# EAGLE design LipSync_Interface_Board (EAGLE 9.0.1)
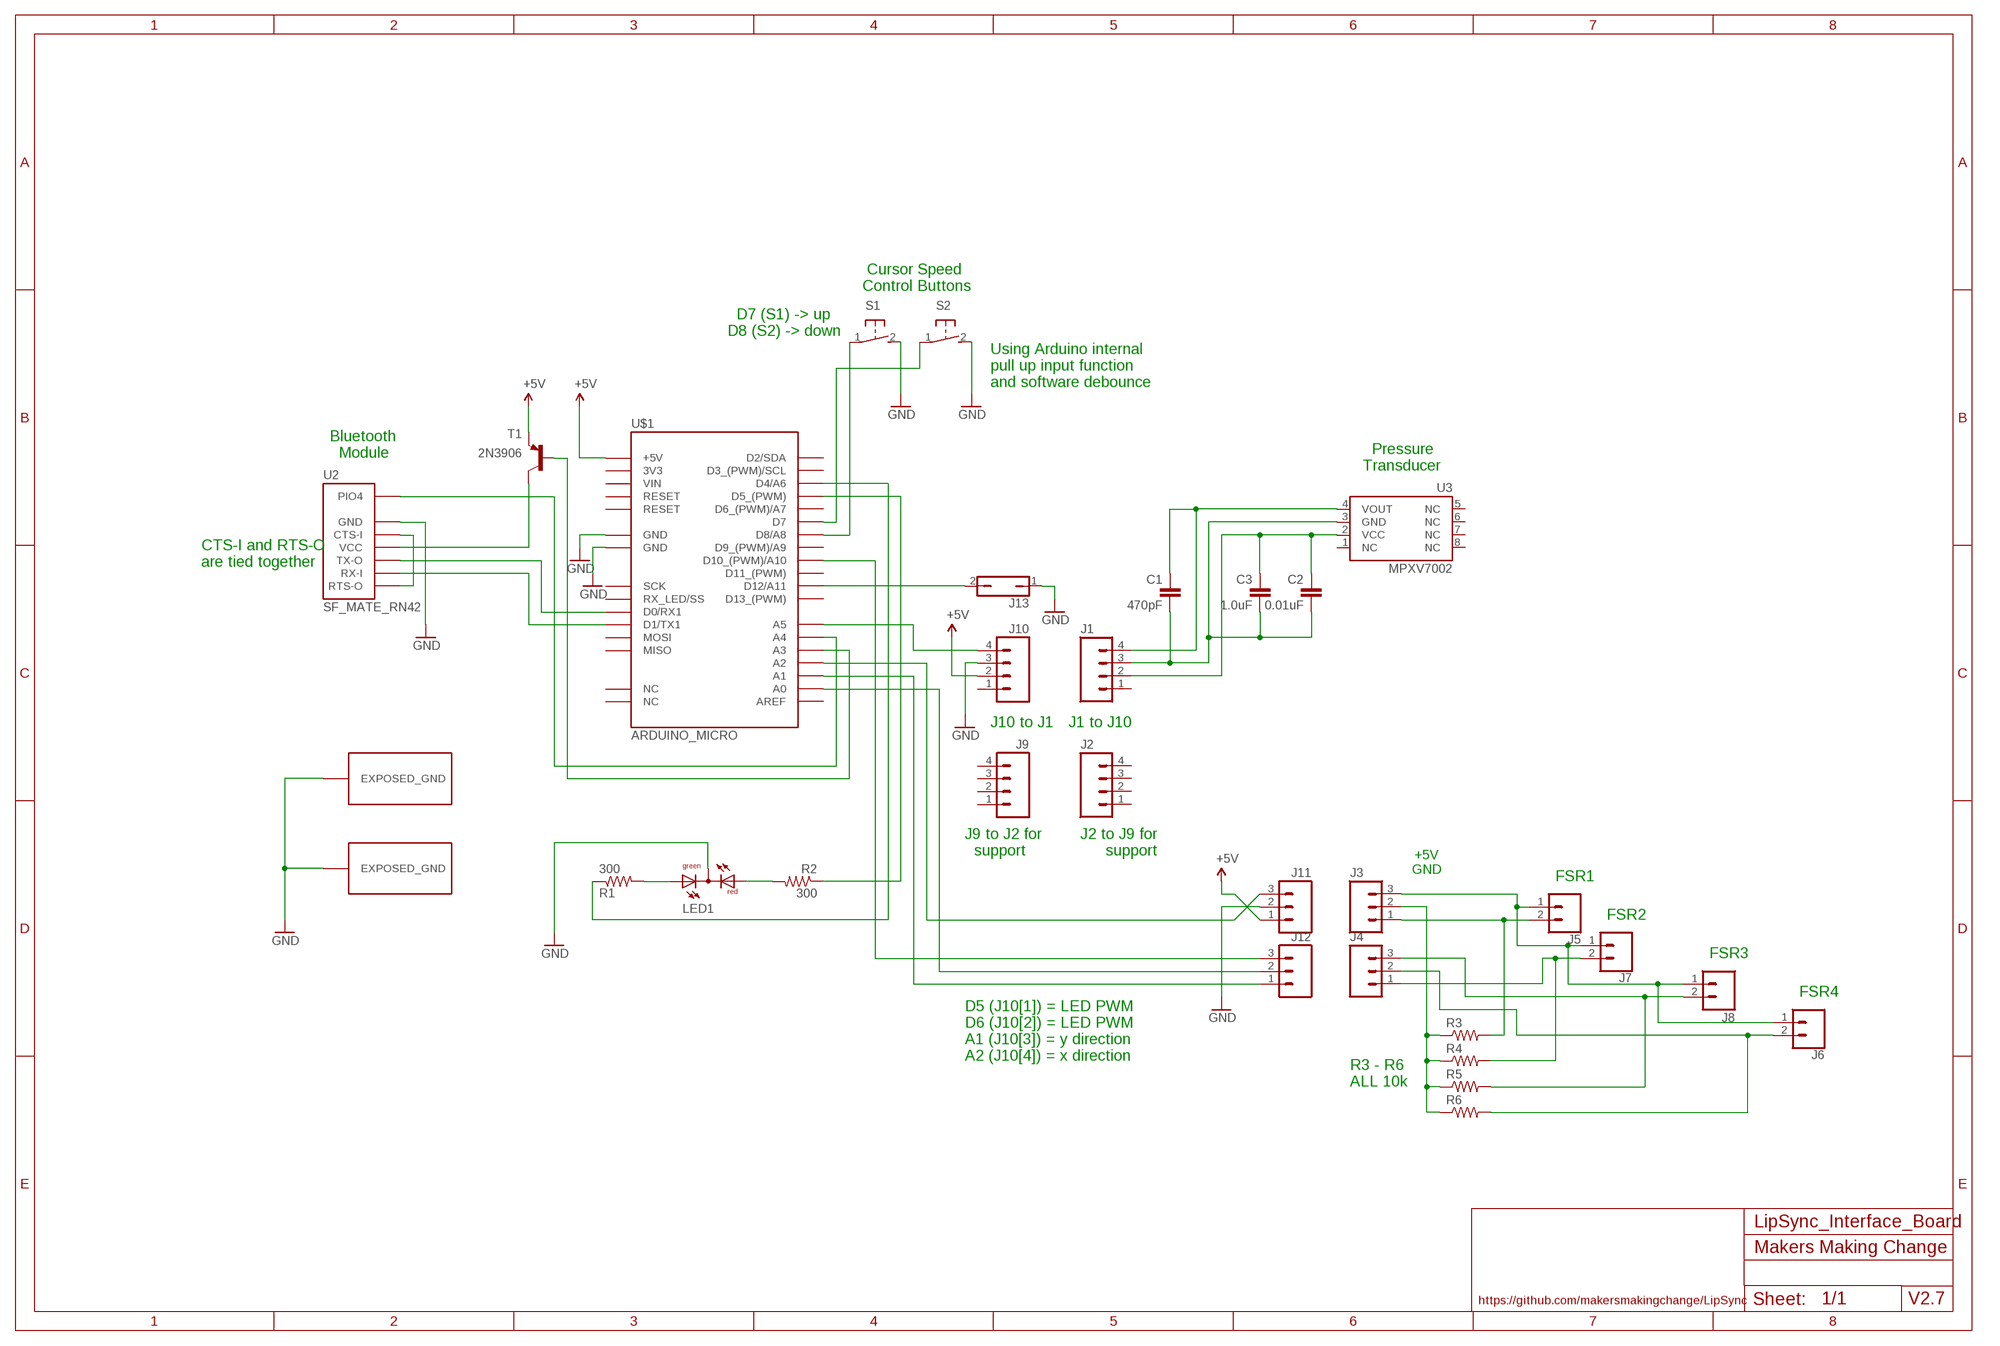
[diagram p0: schematic, sheet 1]

## Parts
C1  470pF  CAPEZ  [CAP-PTH-SMALLEZ]
C2  0.01uF  CAPEZ  [CAP-PTH-SMALLEZ]
C3  1.0uF  CAPEZ  [CAP-PTH-SMALLEZ]
J1  M04PTH  [1X04]
J2  M04PTH  [1X04]
J3  M03LOCK  [1X03_LOCK]
J4  M03LOCK  [1X03_LOCK]
J5  CONN_02PTH3  [1X02_LONGPADS]
J6  CONN_02PTH3  [1X02_LONGPADS]
J7  CONN_02PTH3  [1X02_LONGPADS]
J8  M02PTH3  [1X02_LONGPADS@1]
J9  M04PTH  [1X04]
J10  M04PTH  [1X04]
J11  M03LOCK  [1X03_LOCK]
J12  M03LOCK  [1X03_LOCK]
J13  JP1Q  [JP1]
LED1  DUOLED-RG-C  [DUOLED-C-5MM]
R1  300  RESISTORAXIAL-0.3  [AXIAL-0.3]
R2  300  RESISTORAXIAL-0.3  [AXIAL-0.3]
R3  R-US_0204/5  [0204/5]
R4  R-US_0204/5  [0204/5]
R5  R-US_0204/5  [0204/5]
R6  R-US_0204/5  [0204/5]
S1  31-XXB3F-31XX-CUSTOM  [B3F-31XX-CUSTOM]
S2  31-XXB3F-31XX-CUSTOM  [B3F-31XX-CUSTOM]
T1  2N3906  2N3906-PNP-TO92-EBC  [TO92-EBC]
U2  SF_MATE_RN42  [BLUE_MATE_RN42_HEADER_FOOTPRINT]
U3  MPXV7002  [SOP8]
U$1  ARDUINO_MICRO  [ARDUINO_MICRO_HEADER_FOOTPRINT]
U$2  EXPOSED_GND  [EXPOSED_GND]
U$3  EXPOSED_GND  [EXPOSED_GND]

## Nets
GND: J10.3 J11.2 J13.1 LED1.C S1.2(S) S2.2(S) U2.GND U$1.GND U$1.GND@1(GND) U$2.GND1(EXPOSED_GND) U$3.GND1(EXPOSED_GND)
GND2 [GND2]: C1.2 C2.2 C3.2 J1.3 U3.3(GND)
GND3: J3.2 R3.1 R4.1 R5.1 R6.1
N$1: U2.PIO4 U$1.A4
N$2: T1.C U2.VCC
N$3: U2.TX-O U$1.RX1(D0/RX1)
N$4: U2.RX-I U$1.TX1(D1/TX1)
N$5: J12.2 U$1.A0
N$6: J12.1 U$1.A1
N$7: C1.1 J1.4 U3.4(VOUT)
N$8: C2.1 C3.1 J1.2 U3.2(VCC)
N$9: U2.CTS-I U2.RTS-O
N$10: J12.3 U$1.D10(D10_(PWM)/A10)
N$11: J10.4 U$1.A5
N$12: LED1.AX(AG) R1.P$2
N$13: LED1.AR R2.P$2
N$14: S1.1(P) U$1.D8(D8/A8)
N$15: S2.1(P) U$1.D7
N$16: J3.3 J5.1 J6.1 J7.1 J8.1
N$18: R1.P$1 U$1.D4(D4/A6)
N$19: R2.P$1 U$1.D5(D5_(PWM))
N$20: T1.B U$1.A3
N$21: J11.3 U$1.A2
N$22: J3.1 J5.2 R3.2
N$23: J13.2 U$1.D12(D12/A11)
N$24: J4.1 J7.2 R4.2
N$27: J4.3 J8.2 R5.2
N$28 [GND3]: J4.2 J6.2 R6.2
VCC: J10.2 J11.1 T1.E U$1.5V(+5V) ; supply symbol labelled +5V
Unconnected: J1.1 J2.1 J2.2 J2.3 J2.4 J9.1 J9.2 J9.3 J9.4 J10.1 U3.1(NC) U3.5(NC) U3.6(NC) U3.7(NC) U3.8(NC) U$1.D2(D2/SDA) U$1.D3(D3_(PWM)/SCL) U$1.D6(D6_(PWM)/A7) U$1.D9(D9_(PWM)/A9) U$1.D11(D11_(PWM)) U$1.D13(D13_(PWM)) U$1.MISO U$1.MOSI U$1.NC U$1.NC@1(NC) U$1.REF(AREF) U$1.RST(RESET) U$1.RST@1(RESET) U$1.SCK U$1.SS(RX_LED/SS) U$1.VIN

## Notes on the sheet
- Cursor Speed
  Control Buttons
- D7 (S1) -> up
  D8 (S2) -> down
- Using Arduino internal
  pull up input function
  and software debounce
- Bluetooth
    Module
- Pressure
  Transducer
- CTS-I and RTS-O 
  are tied together
- J10 to J1 | J1 to J10
- J9 to J2 for
    support
- J2 to J9 for
    support
- +5V
  GND
- FSR1
- FSR2
- FSR3
- FSR4
- D5 (J10[1]) = LED PWM
  D6 (J10[2]) = LED PWM
  A1 (J10[3]) = y direction
  A2 (J10[4]) = x direction
- R3 - R6
  ALL 10k
- Makers Making Change
- https://github.com/makersmakingchange/LipSync | V2.7

## Power pins joined to a net without a drawn wire
3V3: U$1.3V3

## Library data of the parts
C1-C3 = SparkFun-Capacitors:CAP: Capacitor Standard 0603 ceramic capacitor, and 0.1" leaded capacitor.
J1 J2 J9 J10 = SparkFun-Connectors:M04: Header 4 Standard 4-pin 0.1" header. Use with straight break away headers (SKU : PRT-00116), right angle break away headers (PRT-00553), swiss pins (PRT-00743), machine pins (PRT-00117), and female headers (PRT-00115). Molex polarized connector foot print use with SKU : PRT-08231 with associated crimp pins and housings. 1MM SMD Version SKU: PRT-10208; PROD_ID: CONN-09696
J3 J4 J11 J12 = SparkFun-Connectors:M03: Header 3 Standard 3-pin 0.1" header. Use with straight break away headers (SKU : PRT-00116), right angle break away headers (PRT-00553), swiss pins (PRT-00743), machine pins (PRT-00117), and female headers (PRT-00115). Molex polarized connector foot print use with SKU : PRT-08232 with associated crimp pins and housings.
J5-J7 = SparkFun-Connectors:CONN_02: Multi connection point. Often used as Generic Header-pin footprint for 0.1 inch spaced/style header connections On any of the 0.1 inch spaced packages, you can populate with these: Break Away Headers - Straight <https://www.sparkfun.com/products/116> (PRT-00116) Break Away Male Headers - Right Angle <https://www.sparkfun.com/products/553> (PRT-00553) Female Headers <https://www.sparkfun.com/products/115> (PRT-00115) Break Away Headers - Machine Pin <https://www.sparkfun.com/products/117> (PRT-00117) Break Away Female Headers - Swiss Machine Pin <https://www.sparkfun.com/products/743> (PRT-00743) For SCREWTERMINALS and SPRING TERMINALS visit here: Screw Terimnals on SparkFun.com <https://www.sparkfun.com/search/results?term=Screw+Terminals> (5mm/3.5mm/2.54mm spacing) This device is also useful as a general connection point to wire up your design to another part of your project. Our various solder wires solder well into these plated through hole pads. Hook-Up Wire - Assortment (Stranded, 22 AWG) <https://www.sparkfun.com/products/11375> (PRT-11375) Hook-Up Wire - Assortment (Solid Core, 22 AWG) <https://www.sparkfun.com/products/11367> (PRT-11367) View the entire wire category on our website here <https://www.sparkfun.com/categories/141> Special notes: Molex polarized connector foot print use with: PRT-08233 with associated crimp pins and housings. 2.54_SCREWTERM for use with PRT-10571. 3.5mm Screw Terminal footprints for PRT-08084 5mm Screw Terminal footprints for use with PRT-08432
J8 = SparkFun-Connectors:M02: Standard 2-pin 0.1" header. Use with - straight break away headers ( PRT-00116) - right angle break away headers (PRT-00553) - swiss pins (PRT-00743) - machine pins (PRT-00117) - female headers (PRT-00115) Molex polarized connector foot print use with: PRT-08233 with associated crimp pins and housings. 2.54_SCREWTERM for use with PRT-10571. 3.5mm Screw Terminal footprints for PRT-08084 5mm Screw Terminal footprints for use with PRT-08432
J13 = jumper:JP1Q: JUMPER
LED1 = led:DUOLED-RG-C: DUO LED 2 colors (red/green), 5 mm, round, common Cathode www.ligitek.com or other producers.
R1 R2 = SparkFun-Passives:RESISTOR: Resistor Basic schematic elements and footprints for 0603, 1206, and PTH resistors.
R3-R6 = resistor:R-US_: RESISTOR, American symbol
S1 S2 = switch-omron:31-XX: OMRON SWITCH
T1 = transistor-neu-to92:*-PNP-: PNP Transistror
U2 = IVAN_custom:SF_MATE_RN42: BlueSMiRF Silver Bluetooth Modem produced by SparkFun. This module uses the Bluetooth RN42 module. More information: SparkFun BlueSMiRF - Silver <https://www.sparkfun.com/products/12582> and Microchip RN42 <http://www.microchip.com/wwwproducts/en/RN42>
U3 = IVAN_custom:MPXV7002: The MPXC7002 dual port differential sensor has an operating pressure of +/- 0.29psi with a maximum pressure of 10psi. The sensor occupies a SOP8 footprint with a 0.1" lead pitch.
U$1 = IVAN_custom:ARDUINO_MICRO: Arduino Micro created through the collaboration of Arduino and Adafruit. The digital pins appropriately listed can output PWM and input analog as well as digital signals. Further information: Arduino Micro <https://www.arduino.cc/en/Main/ArduinoBoardMicro>
U$2 U$3 = IVAN_custom:EXPOSED_GND: Exposed copper plane to connect ground to conductive ABS housing

## Net classes
0 GND: clearance 0.205 mm
2 GND2: clearance 0.205 mm to class 0, clearance 0.205 mm to class 1, clearance 0.205 mm
3 GND3: clearance 0.205 mm to class 0, clearance 0.205 mm to class 1, clearance 0.205 mm to class 2, clearance 0.205 mm

## Board
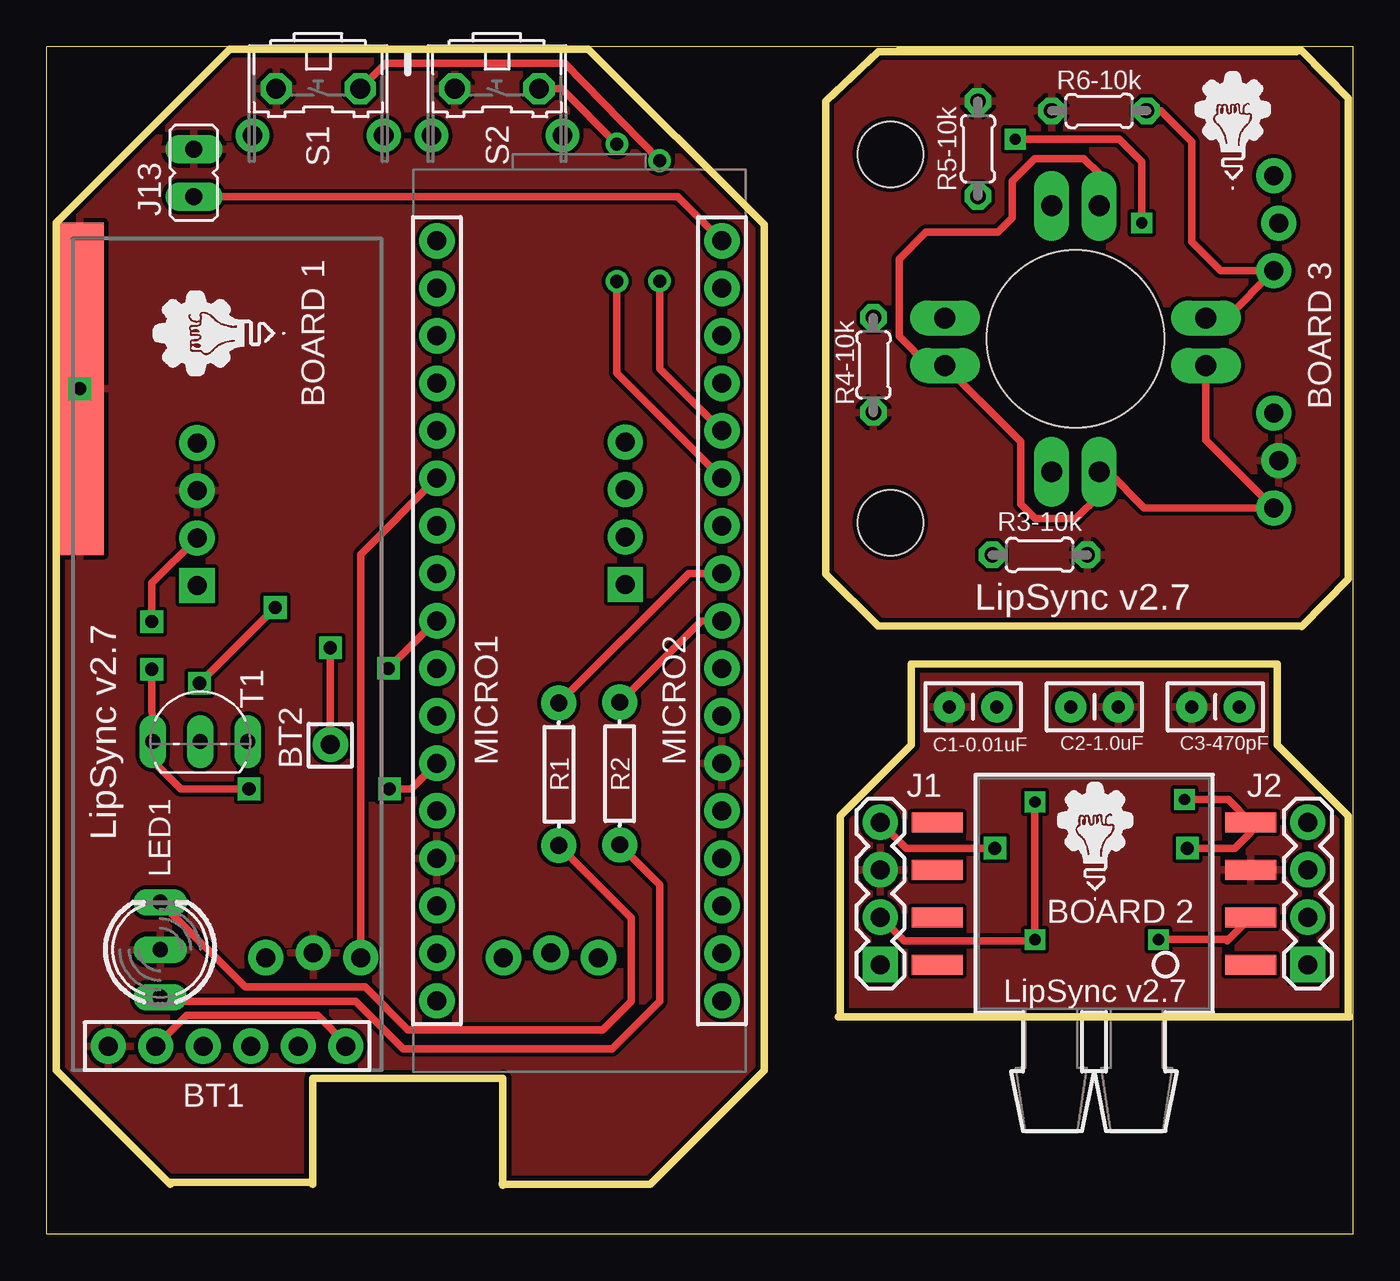
[diagram p1: board, top side]
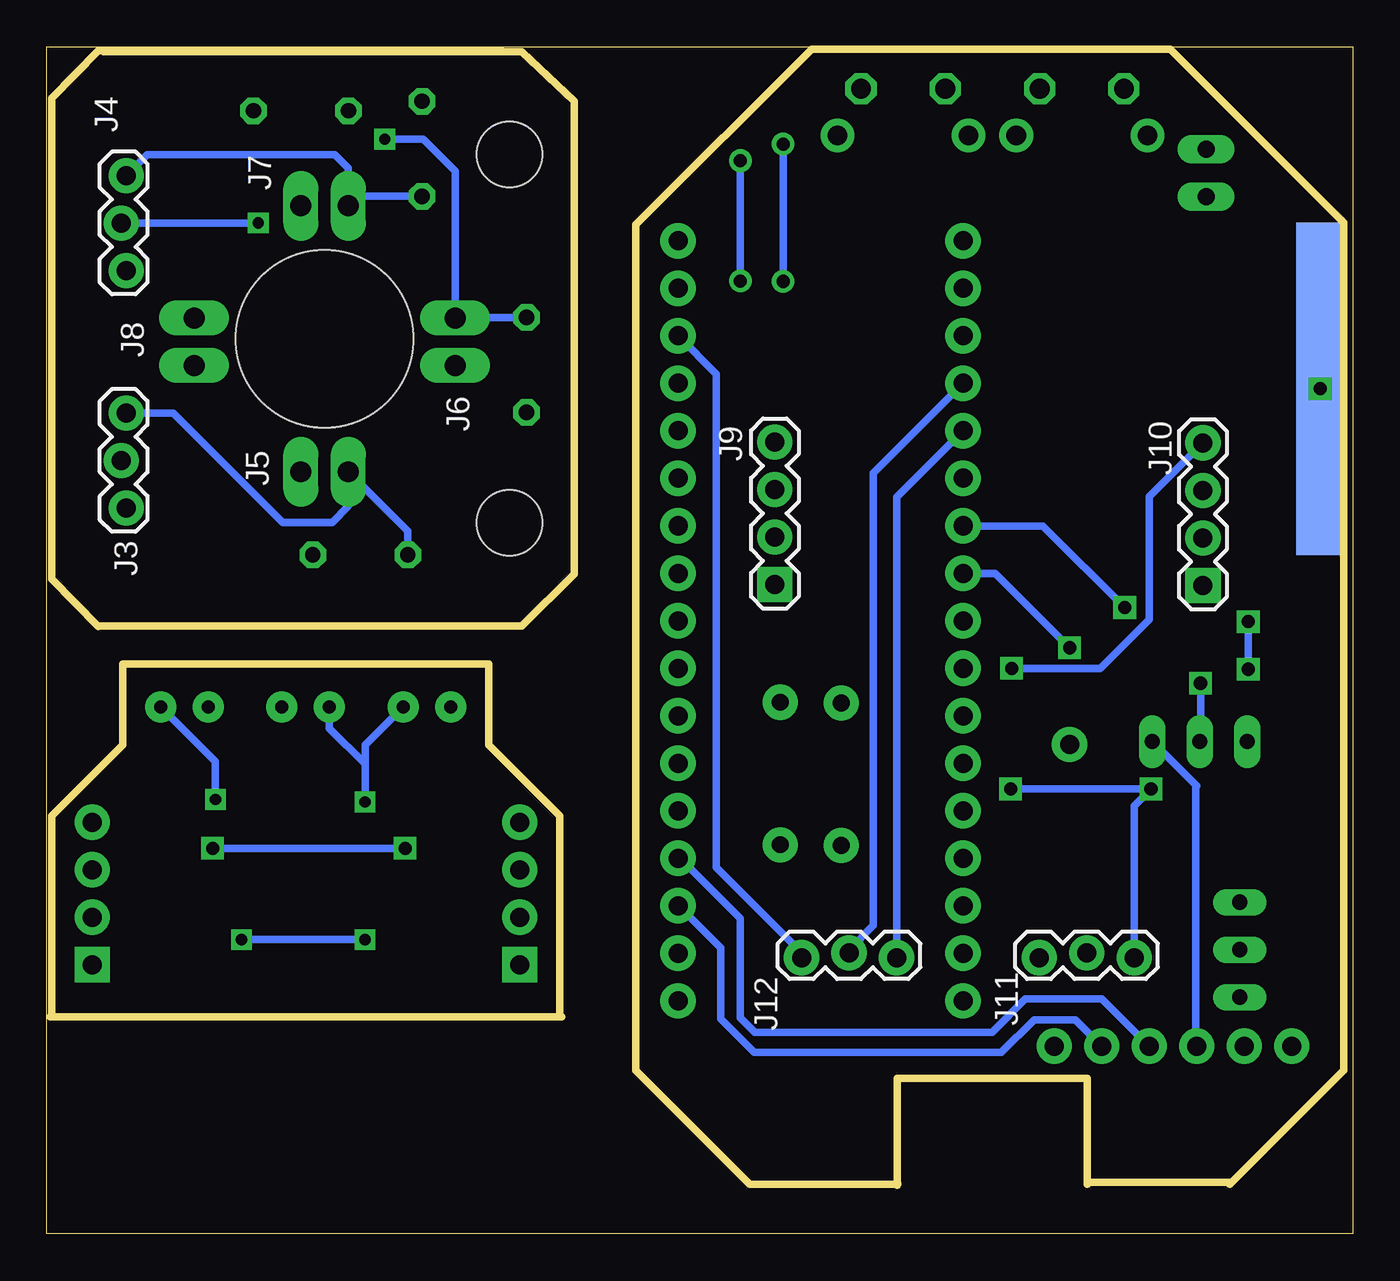
[diagram p2: board, bottom side, seen from below]

Size 69.85 x 63.5 mm. Coordinates in mm from the lower left corner, seen from the top.
Outline: 6.6,2.67 0.51,8.76 0.51,54.1 9.78,63.37 28.96,63.37 38.35,53.98 38.35,8.76 32.26,2.67
Outline: 69.67,11.61 42.32,11.61
Outline: 45.54,63.28 67.09,63.28 69.59,60.74 69.59,35.02 67.09,32.48
Outline: 14.22,2.65 14.22,8.33 24.38,8.33 24.38,2.6
Outline: 14.21,2.75 6.62,2.75 6.62,2.65
Outline: 32.27,2.65 24.36,2.65 24.36,2.71
Outline: 46.3,30.48 65.79,30.48 65.79,26.16 69.6,22.35 69.6,11.68
Outline: 66.8,63.25 44.45,63.25 41.66,60.58 41.66,35.31 44.45,32.51 67.09,32.51
Outline: 46.23,30.48 46.23,26.16 42.42,22.35 42.42,11.68
Outline: 0,0 69.85,0 69.85,63.5 0,63.5 0,0
Copper layers (1*16): Top 0.035mm / dielectric 1.5mm / Bottom 0.035mm
Design rules "SparkFun": minimum track width 8mil, minimum drill 20mil, track to track 8mil, track to pad 8mil, pad to pad 8mil, via to via 8mil, smd to smd 8mil, copper to edge 10mil, drill to drill 8mil, minimum pad ring 12mil, minimum via ring 10mil, stop-mask expansion 4mil, vias tented up to drill 25mil, thermal gap 10mil
Holes 9.5 mm at 54.99,47.88
Holes 3.5 mm at 45.11,38.04 45.11,57.74

### Footprints (pad centres in the part's own frame; a part is rotated, then mirrored left to right if it is on the bottom)
CAP-PTH-SMALLEZ = drill 0.7 pad 1.651: 1 0,0; 2 2.54,0
1X04 = drill 1.016 pad 1.88 square: 1 0,0 | drill 1.016 pad 1.88: 2 2.54,0; 3 5.08,0; 4 7.62,0
1X03_LOCK = drill 1.016 pad 1.88: 1 0,0.127; 2 2.54,-0.127; 3 5.08,0.127
1X02_LONGPADS = drill 1.118 pad 1.88 long: 1 0,0; 2 2.54,0
1X02_LONGPADS@1 = drill 1.118 pad 1.88 long: 1 0,0; 2 2.54,0
JP1 = drill 0.914 long: 1 0,-1.27; 2 0,1.27
DUOLED-C-5MM = drill 0.813 long: AR 2.54,0; AX -2.54,0; C 0,0
AXIAL-0.3 = drill 0.9 pad 1.88: P$1 -3.81,0; P$2 3.81,0
0204/5 = drill 0.813 octagon: 1 -2.54,0; 2 2.54,0
B3F-31XX-CUSTOM = drill 1.05 pad 1.6 octagon: 1 -2.25,-1.245; 2 2.25,-1.245 | drill 1.05 pad 1.8: 3 -3.505,1.245; 4 3.505,1.245
TO92-EBC = drill 0.813 long: B 0,-1.27; C 2.54,-1.27; E -2.54,-1.27
BLUE_MATE_RN42_HEADER_FOOTPRINT = drill 1.016 pad 1.88: CTS-I 1.27,12.065; GND 1.27,14.605; PIO4 17.399,2.731; RTS-O 1.27,1.905; RX-I 1.27,4.445; TX-O 1.27,6.985; VCC 1.27,9.525
SOP8 = smd 2.731 x 1.067: 1 8.382,-3.81; 2 8.382,-1.27; 3 8.382,1.27; 4 8.382,3.81; 5 -8.382,3.81; 6 -8.382,1.27; 7 -8.382,-1.27; 8 -8.382,-3.81
ARDUINO_MICRO_HEADER_FOOTPRINT = drill 1.016 pad 1.88: 3V3 16.51,6.35; 5V 16.51,31.75; A0 16.51,11.43; A1 16.51,13.97; A2 16.51,16.51; A3 16.51,19.05; A4 16.51,21.59; A5 16.51,24.13; D2 1.27,29.21; D3 1.27,26.67; D4 1.27,24.13; D5 1.27,21.59; D6 1.27,19.05; D7 1.27,16.51; D8 1.27,13.97; D9 1.27,11.43; D10 1.27,8.89; D11 1.27,6.35; D12 1.27,3.81; D13 16.51,3.81; GND 1.27,31.75; GND@1 16.51,36.83; MISO 16.51,41.91; MOSI 1.27,44.45; NC 16.51,26.67; NC@1 16.51,29.21; REF 16.51,8.89; RST 1.27,34.29; RST@1 16.51,34.29; RX1 1.27,36.83; SCK 16.51,44.45; SS 1.27,41.91; TX1 1.27,39.37; VIN 16.51,39.37
EXPOSED_GND = smd 2.54 x 17.78: GND1 0,0

### Placement (x,y rotation side)
C1  63.75,28.19 180 top
C2  54.74,28.19 0 top
C3  50.8,28.19 180 top
J1  44.57,14.4 90 top
J2  67.43,14.4 90 top
J3  65.74,43.91 270 bottom
J4  65.74,56.61 270 bottom
J5  56.26,40.77 0 bottom
J6  48.02,46.45 90 bottom
J7  56.26,54.99 0 bottom
J8  61.97,46.46 90 bottom
J9  30.92,34.73 90 bottom
J10  8.03,34.69 90 bottom
J11  11.72,14.9 180 bottom
J12  24.42,14.9 180 bottom
J13  7.87,56.76 180 top
LED1  6.07,15.21 90 top
R1  30.63,24.63 270 top
R2  27.38,24.59 270 top
R3  53.09,36.32 180 top
R4  49.78,58.04 270 top
R5  56.26,60.07 0 top
R6  44.2,46.48 90 top
S1  14.51,60.01 180 top
S2  24.07,60.01 180 top
T1  8.21,27.61 0 top
U2  17.9,8.78 90 top
U3  56,18.21 0 top
U$1  37.37,56.93 180 top
U$2  1.76,45.2 0 top
U$3  1.76,45.2 0 bottom

### Tracks (layer width: path | path; a pad name or v marks a point on that pad's centre or on a via)
GND  (via drill 0.7)
  other vias: 1.76,45.2
  pour Top: 0.51,54.1 9.78,63.37 28.96,63.37 38.35,53.98 38.35,8.76 32.26,2.67 6.6,2.67 0.51,8.76
GND2
  pour Top: 42.42,11.56 42.42,22.48 46.23,26.29 46.23,30.48 65.79,30.48 65.79,26.29 69.6,22.48 69.6,11.68 69.47,11.56
GND3
  pour Top: 67.04,32.54 44.34,32.54 41.64,35.37 41.64,60.59 44.34,63.29 66.99,63.29 69.59,60.69 69.59,34.99 67.09,32.49
N$1  (via drill 0.7)
  Top 0.406: v15.16,31.36 15.16,26.33 U2.PIO4
  Bottom 0.406: U$1.A4 19.15,35.34 v15.16,31.36
N$2
  Bottom 0.406: T1.C 8.41,24.01 | 8.41,24.01 8.37,23.96 | U2.VCC 8.41,10.05 8.41,24.01
N$3
  Bottom 0.406: U$1.RX1 35.97,20.1 32.77,16.89 32.77,11.56 32,10.79 19.3,10.79 17.53,12.57 13.44,12.57 U2.TX-O
N$4
  Bottom 0.406: U2.RX-I 14.86,11.46 17.07,11.46 18.82,9.71 32.02,9.71 33.81,11.51 33.81,15.3 36.07,17.56 U$1.TX1
N$5
  Bottom 0.406: U$1.A0 25.65,40.7 25.65,16.51 26.96,15.21 J12.2
N$6
  Bottom 0.406: U$1.A1 24.42,39.4 J12.1
N$7  (via drill 0.6, 0.7 pad 1.02)
  Top 0.406: v60.98,20.63 63.52,20.63 64.38,21.48 U3.4 63.16,23.24 v60.83,23.24 | v50.69,20.63 45.96,20.63 J1.4
  Bottom 0.406: v60.98,20.63 v50.69,20.63 | v60.83,23.24 60.83,25.27 C1.1
N$8  (via drill 0.6)
  Top 0.406: J1.2 45.84,15.67 52.76,15.67 v52.83,15.75 v52.83,23.11 | U3.2 63.11,15.67 63.03,15.75 v59.44,15.75
  Bottom 0.406: v52.83,15.75 v59.44,15.75 | C3.1 52.83,26.16 52.83,25.15 | 52.83,25.15 v52.83,23.11 | C2.1 54.74,27.05 52.83,25.15
N$9
  Top 0.406: U2.CTS-I 7.47,11.68 14.48,11.68 15.99,10.17 U2.RTS-O
N$10
  Bottom 0.406: U$1.D10 34.06,46 34.06,19.61 29.5,15.04 J12.3
N$11  (via drill 0.7)
  Top 0.406: U$1.A5 20.81,32.8 v18.27,30.25
  Bottom 0.406: v18.27,30.25 13.52,30.25 10.91,32.85 10.91,39.43 J10.4
N$12
  Top 0.406: R1.P$2 32.77,18.68 32.77,12.45 30.23,9.91 19.05,9.91 16.51,12.45 6.29,12.45 LED1.AX
N$13
  Top 0.406: R2.P$2 31.24,16.91 31.24,12.45 29.72,10.92 19.3,10.92 17.02,13.21 10.61,13.21 LED1.AR
N$14  (via drill 0.7 pad 1.02)
  Top 0.406: S1.1 18.13,62.61 27.69,62.61 v32.77,57.4 | 36.04,42.96 U$1.D8 32.77,46.29 v32.77,50.97
  Bottom 0.406: v32.77,57.4 v32.77,50.97
N$15  (via drill 0.7 pad 1.02)
  Top 0.406: S2.1 27.52,61.25 v30.48,58.29 | v30.48,50.95 30.48,46.04 U$1.D7
  Bottom 0.406: v30.48,58.29 v30.48,50.95
N$16
  Top 0.406: J8.1 61.97,42.47 J3.3 58.67,38.83 56.74,40.77 J5.1 56.26,39.5 55.03,38.27 52.86,38.27 52.08,39.05 52.08,42.38 J6.1 47.13,46.45 45.56,48.02 45.56,52.14 47,53.57 50.84,53.57 51.63,54.36 51.63,56.3 52.83,57.5 54.84,57.5 54.85,57.51 55.45,57.51 56.26,56.7 J7.1
N$18
  Top 0.406: R1.P$1 34.99,32.8 U$1.D4
N$19
  Top 0.406: R2.P$1 34.31,35.34 U$1.D5
N$20  (via drill 0.7)
  Top 0.406: v12.21,33.51 v8.16,29.45
  Bottom 0.406: U$1.A3 16.59,37.88 v12.21,33.51 | v8.16,29.45 8.16,26.38 T1.B
N$21
  Top 0.406: J11.3 16.8,36.35 U$1.A2
N$22
  Bottom 0.406: J3.1 63.09,43.91 57.24,38.06 54.58,38.06 53.72,38.92 J5.2 50.55,37.59 R3.2
N$23
  Top 0.406: J13.2 33.73,55.48 U$1.D12
N$24
  Bottom 0.406: R4.2 53.21,55.5 J7.2 53.72,57 54.46,57.74 64.48,57.74 J4.1
N$27
  Top 0.406: R5.2 59.56,60.07 61.21,58.42 61.21,53.09 62.77,51.53 J4.3 63.08,48.99 J8.2
N$28  (via drill 0.6)
  Top 0.406: v51.78,58.56 57.34,58.56 58.54,57.36 v58.54,54.07
  Bottom 0.406: R6.2 47.98,49.02 J6.2 48.02,56.17 48.01,56.18 48.01,56.84 49.72,58.56 v51.78,58.56 | J4.2 58.75,54.07 v58.54,54.07
VCC  (via drill 0.7)
  Top 0.406: v10.81,23.8 7.17,23.8 5.67,25.3 T1.E 5.62,28.39 v5.62,30.2 | v5.62,32.76 5.62,34.81 J10.2 | v18.32,23.8 19.49,23.8 U$1.5V
  Bottom 0.406: v18.32,23.8 v10.81,23.8 11.72,22.9 J11.1 | v5.62,30.2 v5.62,32.76

### Text on the board
tNames: R6-10k | R5-10k | S1 | S2 | J13 | BOARD 1 | BOARD 3 | R4-10k | R3-10k | LipSync v2.7 | T1 | C1-0.01uF | C2-1.0uF | C3-470pF | BT2 | MICRO1 | MICRO2 | R1 | R2 | J1 | J2 | LipSync v2.7 | LED1 | BOARD 2 | LipSync v2.7 | BT1
bNames: J4 | J7 | J8 | J6 | J10 | J9 | J5 | J3 | J11 | J12